# EasyEDA Pro project ProPrj_逆变电路（单相三相）_2026-01-25.epro, schematic Schematic1_1
Board Name: 重置_单相双向逆变电路; Create Date: 2025-07-20; Page Name: 逆变电路; Project Name: 逆变电路（单相三相）; Schematic Name: Schematic1_1; Update Date: 2025-07-20; Company: 嘉立创EDA; Page Size: A4; Version: V1.0
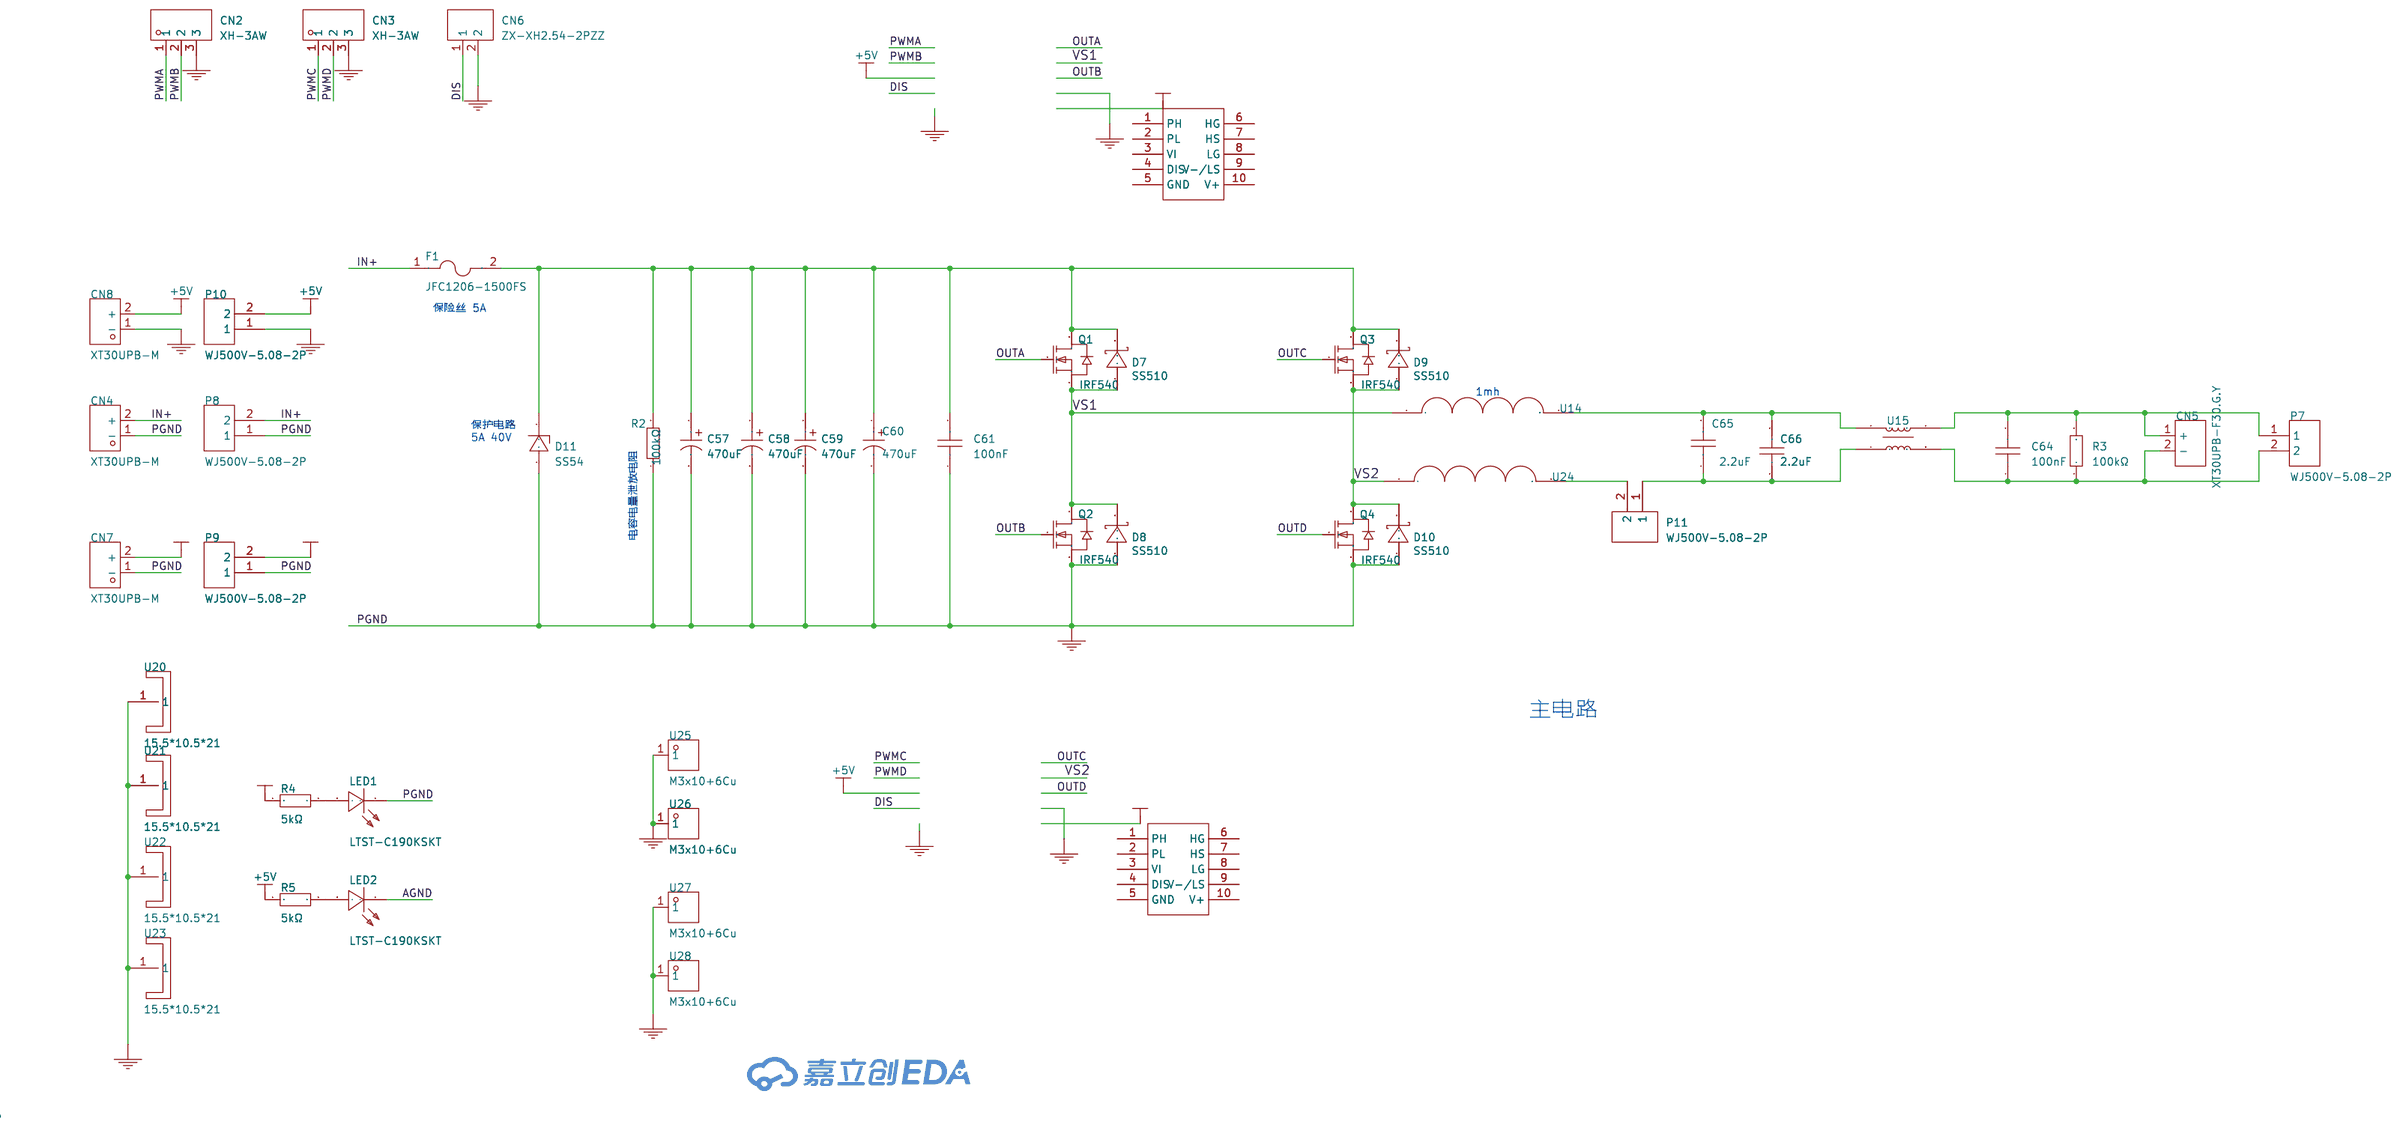
[diagram p1: schematic sheet]

## Parts
C57  470uF  [CAP-TH_BD8.0-P3.50-D0.6-FD_1]
C58  470uF  [CAP-TH_BD8.0-P3.50-D0.6-FD_1]
C59  470uF  [CAP-TH_BD8.0-P3.50-D0.6-FD_1]
C60  470uF  [CAP-TH_BD8.0-P3.50-D0.6-FD_1]
C61  100nF  [C0603]
C64  100nF  [C0603]
C65  2.2uF  [CAP-TH_L21.3-W9.4-P20.00-D1.2]
C66  2.2uF  [CAP-TH_L21.3-W9.4-P20.00-D1.2]
CN2  XH-3AW  [CONN-TH_3P-P2.54_HCTL_XH-3AW]
CN3  XH-3AW  [CONN-TH_3P-P2.54_HCTL_XH-3AW]
CN4  XT30UPB-M  [CONN-TH_XT30UPB-M]
CN5  XT30UPB-F30.G.Y  [CONN-TH_XT30UPB-F]
CN6  ZX-XH2.54-2PZZ  [CONN-TH_2P-P2.50_HX25003-2A]
CN7  XT30UPB-M  [CONN-TH_XT30UPB-M]
CN8  XT30UPB-M  [CONN-TH_XT30UPB-M]
D7  SS510  [SMC_L7.1-W6.2-LS8.1-R-RD]
D8  SS510  [SMC_L7.1-W6.2-LS8.1-R-RD]
D9  SS510  [SMC_L7.1-W6.2-LS8.1-R-RD]
D10  SS510  [SMC_L7.1-W6.2-LS8.1-R-RD]
D11  SS54  [SMA_L4.3-W2.6-LS5.0-FD]
F1  JFC1206-1500FS  [F1206]
LED1  LTST-C190KSKT  [LED0603-RD]
LED2  LTST-C190KSKT  [LED0603-RD]
P7  WJ500V-5.08-2P  [CONN-TH_2P-P5.00_WJ500V-5.08-2P]
P8  WJ500V-5.08-2P  [CONN-TH_2P-P5.00_WJ500V-5.08-2P]
P9  WJ500V-5.08-2P  [CONN-TH_2P-P5.00_WJ500V-5.08-2P]
P10  WJ500V-5.08-2P  [CONN-TH_2P-P5.00_WJ500V-5.08-2P]
P11  WJ500V-5.08-2P  [CONN-TH_2P-P5.00_WJ500V-5.08-2P]
Q1  IRF540  [TO-220AB-3_L10.4-W4.6-P2.54-L]
Q2  IRF540  [TO-220AB-3_L10.4-W4.6-P2.54-L]
Q3  IRF540  [TO-220AB-3_L10.4-W4.6-P2.54-L]
Q4  IRF540  [TO-220AB-3_L10.4-W4.6-P2.54-L]
R2  100kΩ  [R0603]
R3  100kΩ  [R0603]
R4  5kΩ  [R0603]
R5  5kΩ  [R0603]
U1  -  [UCC21520模块]
U13  -  [UCC21520模块]
U14  -  [1mH_14*8*7]
U15  -  [共模电感3mH]
U20  15.5*10.5*21  [SINK-TH_L15.0-W10.5-H21.0]
U21  15.5*10.5*21  [SINK-TH_L15.0-W10.5-H21.0]
U22  15.5*10.5*21  [SINK-TH_L15.0-W10.5-H21.0]
U23  15.5*10.5*21  [SINK-TH_L15.0-W10.5-H21.0]
U24  -  [1mH_14*8*7]
U25  M3x10+6Cu  [SMD_L4.7-W4.7-D3.0]
U26  M3x10+6Cu  [SMD_L4.7-W4.7-D3.0]
U27  M3x10+6Cu  [SMD_L4.7-W4.7-D3.0]
U28  M3x10+6Cu  [SMD_L4.7-W4.7-D3.0]

## Library data of the parts
C57-C60 = CD2884771EM0812VFL: 容值:470uF;额定电压:25V;; LCSC Part Name: 470uF 25V; Supplier Part: C2960233; Manufacturer: HRK(鸿瑞凯电子); Supplier Footprint: 插件,D8xL12mm; JLCPCB Part Class: 扩展库; Datasheet: https://atta.szlcsc.com/upload/public/pdf/source/20240703/D49961C1CEC6E325964F7113D69E9087.pdf; Supplier: LCSC; Rated Voltage: 25V; φD: 8mm; L: 12mm; Operating Temperature: -40℃~+105℃
C61 C64 = CGA0603X7R104K500JT: 容值:100nF;精度:±10%;额定电压:50V;温度系数:X7R;; LCSC Part Name: 100nF ±10% 50V; Supplier Part: C6119867; Manufacturer: HRE(芯声); Supplier Footprint: 0603; JLCPCB Part Class: 扩展库; Datasheet: https://atta.szlcsc.com/upload/public/pdf/source/20250103/C44077DA9E7B3EFAE02F22B6D3D1CBC9.pdf; Supplier: LCSC; Tolerance: ±10%; Voltage Rating: 50V; Temperature Coefficient: X7R
C65 C66 = MEF225K2G8AS8034A1: 容值:2.2uF;精度:±10%;额定电压:400V;; LCSC Part Name: 2.2uF ±10% 400V; Supplier Part: C18295922; Manufacturer: JOEY(久亦); Supplier Footprint: 插件,P=20mm; JLCPCB Part Class: 扩展库; Datasheet: https://atta.szlcsc.com/upload/public/pdf/source/20231121/E05CBF93D443A11C4DB99CC58A34DFFF.pdf; Supplier: LCSC; Tolerance: ±10%; Voltage Rating: 400V
CN2 CN3 = XH-3AW_C2908612: 插针结构:1x3P;间距:2.54mm;安装方式:弯插;参考系列:XH;总PIN数:3P;排数:1;每排PIN数:3;行距:-;额定电流:3A;触头材质:黄铜;触头镀层:锡;工作温度范围:-25℃~+85℃;; LCSC Part Name: 1x3P 间距:2.54mm 弯插 系列:XH; Supplier Part: C2908612; Manufacturer: HCTL(华灿天禄); Supplier Footprint: 弯插,P=2.5mm; JLCPCB Part Class: 扩展库; Datasheet: https://atta.szlcsc.com/upload/public/pdf/source/20230711/B565BAF3B11666EF6B81B3605408F2BD.pdf; Supplier: LCSC; Pins Structure: 1x3P; Pitch: 2.54mm; Mounting Style: 弯插; Reference Series: XH; Number of Pins: 3P; Number of Rows: 1; Number of PINs Per Row: 3; Current Rating (Max): 3A; Contact Material: 黄铜; Contact Plating: 锡; Operating Temperature Range: -25℃~+85℃
CN4 CN7 CN8 = XT30UPB-M: 类别:-;类型1:-;; LCSC Part Name: AMASS(艾迈斯)板载立式 航模锂电池控制器连接器插头 公头XT30UPB-M; Supplier Part: C428721; Manufacturer: AMASS(艾迈斯); JLCPCB Part Class: 扩展库; Datasheet: https://atta.szlcsc.com/upload/public/pdf/source/20230412/7B5DFEF57C9EA5273853390C734B3AC5.pdf; Supplier: LCSC; Type: 航模插头; Colour: 黄色; RatedVoltage: DC 500V; InterfaceType: 公头; MetalMaterial: 镀金; InsulationMaterial: PA; RatedCurrent: 15A; contact resistance: 0.65mΩ
CN5 = XT30UPB-F30.G.Y: 类别:-;类型1:-;; LCSC Part Name: AMASS(艾迈斯)直立焊板式连接器XT30UPB30-F.G.*; Supplier Part: C108769; Manufacturer: AMASS(艾迈斯); JLCPCB Part Class: 扩展库; Datasheet: https://atta.szlcsc.com/upload/public/pdf/source/20220715/AFD68B9E8B6CA95A7295DBF4AF9325E4.pdf; Supplier: LCSC; Type: 航模插头; Colour: 黄色; RatedVoltage: DC 500V; InterfaceType: 母头; MetalMaterial: 镀金; InsulationMaterial: PA; RatedCurrent: 15A; contact resistance: 0.65mΩ
CN6 = ZX-XH2.54-2PZZ: 插针结构:1x2P;间距:2.5mm;安装方式:直插;参考系列:XH;总PIN数:2P;排数:1;每排PIN数:2;行距:-;额定电流:3A;触头材质:黄铜;触头镀层:锡;工作温度:-25℃~+85℃;; LCSC Part Name: 1x2P 间距:2.5mm 直插 系列:XH; Supplier Part: C7429632; Manufacturer: Megastar(兆星); Supplier Footprint: 插件,P=2.5mm; JLCPCB Part Class: 扩展库; Datasheet: https://atta.szlcsc.com/upload/public/pdf/source/20230619/19BA6947230AA44A04D3EDD65E618FD0.pdf; Supplier: LCSC; Pins Structure: 1x2P; Pitch: 2.5mm; Mounting Type: 直插; Reference Series: XH; Number of Pins: 2P; Number of Rows: 1; Number of PINs Per Row: 2; Current Rating: 3A; Contact Material: 黄铜; Contact Plating: 锡; Operating Temperature: -25℃~+85℃; Voltage Rating: 250V; Plastic Material: PA66; Flame Retardant Rating: UL94V-0; Color: 白色; Z-Height of the Board: 7mm; X-Length of Bottom Edge on Board (Spacing Line): 7.5mm; Y-Width of Bottom Edge on Board: 5.9mm
D7-D10 = SS510: Supplier: LCSC; Manufacturer: MDD; Supplier Part: C19229; JLCPCB Part Class: Extended Part
D11 = SS54_C7420369: 二极管配置:独立式;正向压降(Vf):550mV@5.0A;直流反向耐压(Vr):40V;整流电流:5A;; LCSC Part Name: 电压:40V 电流:5A; Supplier Part: C7420369; Manufacturer: 宏迦橙; Supplier Footprint: SMA(DO-214AC); JLCPCB Part Class: 扩展库; Datasheet: https://atta.szlcsc.com/upload/public/pdf/source/20230828/254C3882F8647358AD9F60DD73611B5E.pdf; Supplier: LCSC; Diode Configuration: 独立式; Forward Voltage (Vf@If): 550mV@5.0A; Reverse Voltage (Vr): 40V; Rectified Current: 5A; Reverse Leakage Current (Ir): 50uA@40V
F1 = JFC1206-1500FS: 类型:贴片式保险丝;额定电流:5A;额定电压 (AC):32V;额定电压:32V;分断能力:50A;; LCSC Part Name: 5A 32V 贴片式保险丝 快断; Supplier Part: C136351; Manufacturer: JDTfuse(集电通); Supplier Footprint: 1206; JLCPCB Part Class: 扩展库; Datasheet: https://atta.szlcsc.com/upload/public/pdf/source/20230515/8A56624F973AA51D74CDD59D07A1FF42.pdf; Supplier: LCSC; Type: 贴片式保险丝; Current Rating: 5A; Voltage Rating (AC): 32V; Voltage Rating (DC): 32V; Operating Temperature: -55℃~+125℃; Interrupt Rating: 50A
LED1 LED2 = LTST-C190KSKT: 发光颜色:黄色;正向电压(VF):2.1V;功率:75mW;正向电流:20mA;主波长:584.5nm~597nm;二极管配置:-;透镜颜色:无色透明透镜;色温:-;发光强度:104mcd;发光角度:130°;载带方式:-;工作温度:-30℃~+85℃;; LCSC Part Name: 黄灯; Supplier Part: C125095; Manufacturer: LITEON(光宝); Supplier Footprint: 0603; JLCPCB Part Class: 扩展库; Datasheet: https://atta.szlcsc.com/upload/public/pdf/source/20180129/C125095_15171881843821315881.pdf; Supplier: LCSC; Emitted Color: 黄色; Forward Voltage (VF): 2.1V; Power Dissipation: 75mW; Forward Current: 20mA; Dominant Wavelength: 584.5nm~597nm; Peak Wavelength: 588nm; Lens Color: 无色透明透镜; Luminous Intensity: 104mcd; Viewing Angle: 130°; Operating Temperature: -30℃~+85℃
P7-P11 = WJ500V-5.08-2P: 结构:1x2P;间距:5.08mm;颜色:绿色;安装方式:直插;额定电流:18A;额定电压:250V;排数:1;线规 - AWG:14~30;线规 - 平方毫米:2.5;每排PIN数:2;触头材质:-;触头镀层:-;工作温度范围:-40℃~+105℃;焊接温度(最大值):-;; LCSC Part Name: 1x2P 5.08mm 直插 排数:1 每排P数:2; Supplier Part: C8465; Manufacturer: KANGNEX(康奈克斯电气); Supplier Footprint: 插件,P=5.08mm; JLCPCB Part Class: 扩展库; Datasheet: https://atta.szlcsc.com/upload/public/pdf/source/20191225/C8465_02D34CE5B5B4A53DF5891601D97FA9F4.pdf; Supplier: LCSC; Structure: 1x2P; Pitch: 5.08mm; Color: 绿色; Mounting Style: 直插; Current Rating (Max): 18A; Voltage Rating (Max): 250V; Number of Pins: 2P; Number of Rows: 1; Wire Gauge - AWG: 14~30; Wire Gauge - mm2: 2.5; Number of PINs Per Row: 2; Operating Temperature Range: -40℃~+105℃; Screw Specification: M2.5
Q1-Q4 = IRF540: Supplier: LCSC; Supplier Part: C533268; Manufacturer: Infineon Technologies; Manufacturer Part: AUIRF540Z; JLCPCB Part Class: Extended Part
R2 R3 = 0603WAF1003T5E: 电阻类型:厚膜电阻;阻值:100kΩ;精度:±1%;功率:100mW;最大工作电压:75V;温度系数:±100ppm/℃;; LCSC Part Name: 100kΩ ±1% 100mW 厚膜电阻; Supplier Part: C25803; Manufacturer: UNI-ROYAL(厚声); Supplier Footprint: 0603; JLCPCB Part Class: 基础库; Datasheet: https://atta.szlcsc.com/upload/public/pdf/source/20200306/C422600_1E6D84923E4A46A82E41ADD87F860B5C.pdf; Supplier: LCSC; Type: 厚膜电阻; Tolerance: ±1%; Power(Watts): 100mW; Overload Voltage (Max): 75V; Temperature Coefficient: ±100ppm/℃; Operating Temperature Range: -55℃~+155℃
R4 R5 = RT0603BRE075KL: 电阻类型:薄膜电阻;阻值:5kΩ;精度:±0.1%;功率:100mW;温度系数:±50ppm/℃;; LCSC Part Name: 薄膜电阻 5kΩ ±0.1% 100mW; Supplier Part: C862232; Manufacturer: YAGEO(国巨); Supplier Footprint: 0603; JLCPCB Part Class: Extended Part; Datasheet: https://atta.szlcsc.com/upload/public/pdf/source/20200610/C326738_5639A9F1B6EB6E4AE2197577D3456E7F.pdf; Supplier: LCSC; Type: 薄膜电阻; Tolerance: ±0.1%; Power(Watts): 100mW; Temperature Coefficient: ±50ppm/℃; Operating Temperature Range: -55℃~+155℃
U1 U13 = UCC21520驱动模块
U14 U24 = 1mH_14*8*7mm
U15 = 共模电感
U20-U23 = 15.5*10.5*21: 产品尺寸:15.5*10.5*21MM;材 质:6063-T5;; LCSC Part Name: H型散热片; Supplier Part: C4649; Manufacturer: XSD(鑫顺达); JLCPCB Part Class: 扩展库; Datasheet: https://atta.szlcsc.com/upload/public/pdf/source/20171202/C4649_15122106328221160233.pdf; Supplier: LCSC; ProductSize: 15.5*10.5*21MM; Colour: 白色; TextureOfMaterial: 6063-T5; SurfaceTreatment: 本色洗白; Shape: H型; SpringBuckle: -；-；-；-；-；-；-；-
U25-U28 = M3x10+6Cu: M3x10+6; LCSC Part Name: Shuntian(顺天五金) 单头六角隔离铜柱螺柱 M3X10+6 国标 黄铜 袋装; Supplier Part: C551322; Manufacturer: Shuntian(顺天五金); JLCPCB Part Class: 扩展库; Datasheet: https://atta.szlcsc.com/upload/public/pdf/source/20200518/C357406_C09EF4431115B36F205D341EAA7D5F43.pdf; Supplier: LCSC; length: 10mm; diameter: 3mm; Thread length: 6mm; material quality: 黄铜; standard: 国标; surface treatment: 本色; Specifications: M3X10+6; structure type: 单头; Shape Type: 六角; purpose: 隔离; type: 螺柱; hexagonal opposite edge: 4.7mm

## Nets
+5V: CN8.2(+) P10.2 R5.1
+12V: CN7.2(+) P9.2 R4.1
AGND: CN2.3 CN3.3 CN6.2 CN8.1(-) LED2.1(-) P10.1 U25.1 U26.1
PGND: C57.2 C58.2 C59.2 C60.2 C61.1 CN4.1(-) CN7.1(-) D8.1(A) D10.1(A) D11.1(A) LED1.1(-) P8.1 P9.1 Q2.3(S) Q4.3(S) R2.1 U20.1 U21.1 U22.1 U23.1 U27.1 U28.1
DIS: CN6.1
IN+: CN4.2(+) F1.1 P8.2
OUTA: Q1.1(G)
OUTB: Q2.1(G)
OUTC: Q3.1(G)
OUTD: Q4.1(G)
PWMA: CN2.1
PWMB: CN2.2
PWMC: CN3.1
PWMD: CN3.2
VS1: D7.1(A) D8.2(K) Q1.3(S) Q2.2(D) U14.1
VS2: D9.1(A) D10.2(K) Q3.3(S) Q4.2(D) U24.1
$1N14882: C57.1 C58.1 C59.1 C60.1 C61.2 D7.2(K) D9.2(K) D11.2(K) F1.2 Q1.2(D) Q3.2(D) R2.2
$1N16777: C64.2 CN5.1(+) P7.1 R3.2 U15.2
$1N16783: C64.1 CN5.2(-) P7.2 R3.1 U15.3
$1N17145: C65.2 C66.2 U14.2 U15.1
$1N25469: LED1.2(+) R4.2
$1N25627: LED2.2(+) R5.2
$1N25816: P11.2 U24.2
$1N25826: C65.1 C66.1 P11.1 U15.4

Not connected (* = marked no-connect by the designer): U1 1(PH) 2(PL) 3(VI) 4(DIS) 5(GND) 6(HG) 7(HS) 8(LG) 9(V-/LS) 10(V+); U13 1(PH) 2(PL) 3(VI) 4(DIS) 5(GND) 6(HG) 7(HS) 8(LG) 9(V-/LS) 10(V+)

## Notes on the sheet
- 保险丝 5A
- 1mh
- 保护电路
  5A 40V
- 电容电量泄放电阻
- 主电路
